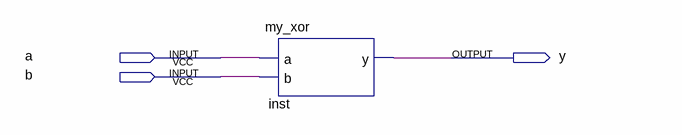
[diagram p0: schematic sheet]
// Quartus schematic my_xor_schematic.bdf as structural Verilog: 1 symbols, 3 pins
module my_xor_schematic (
  input  a,
  input  b,
  output y
);

  my_xor inst (.a(a), .b(b), .y(y));
endmodule
